# EAGLE design Charger Control Board rev6 (EAGLE 9.6.2)

## Sheet 1 of 2: Main
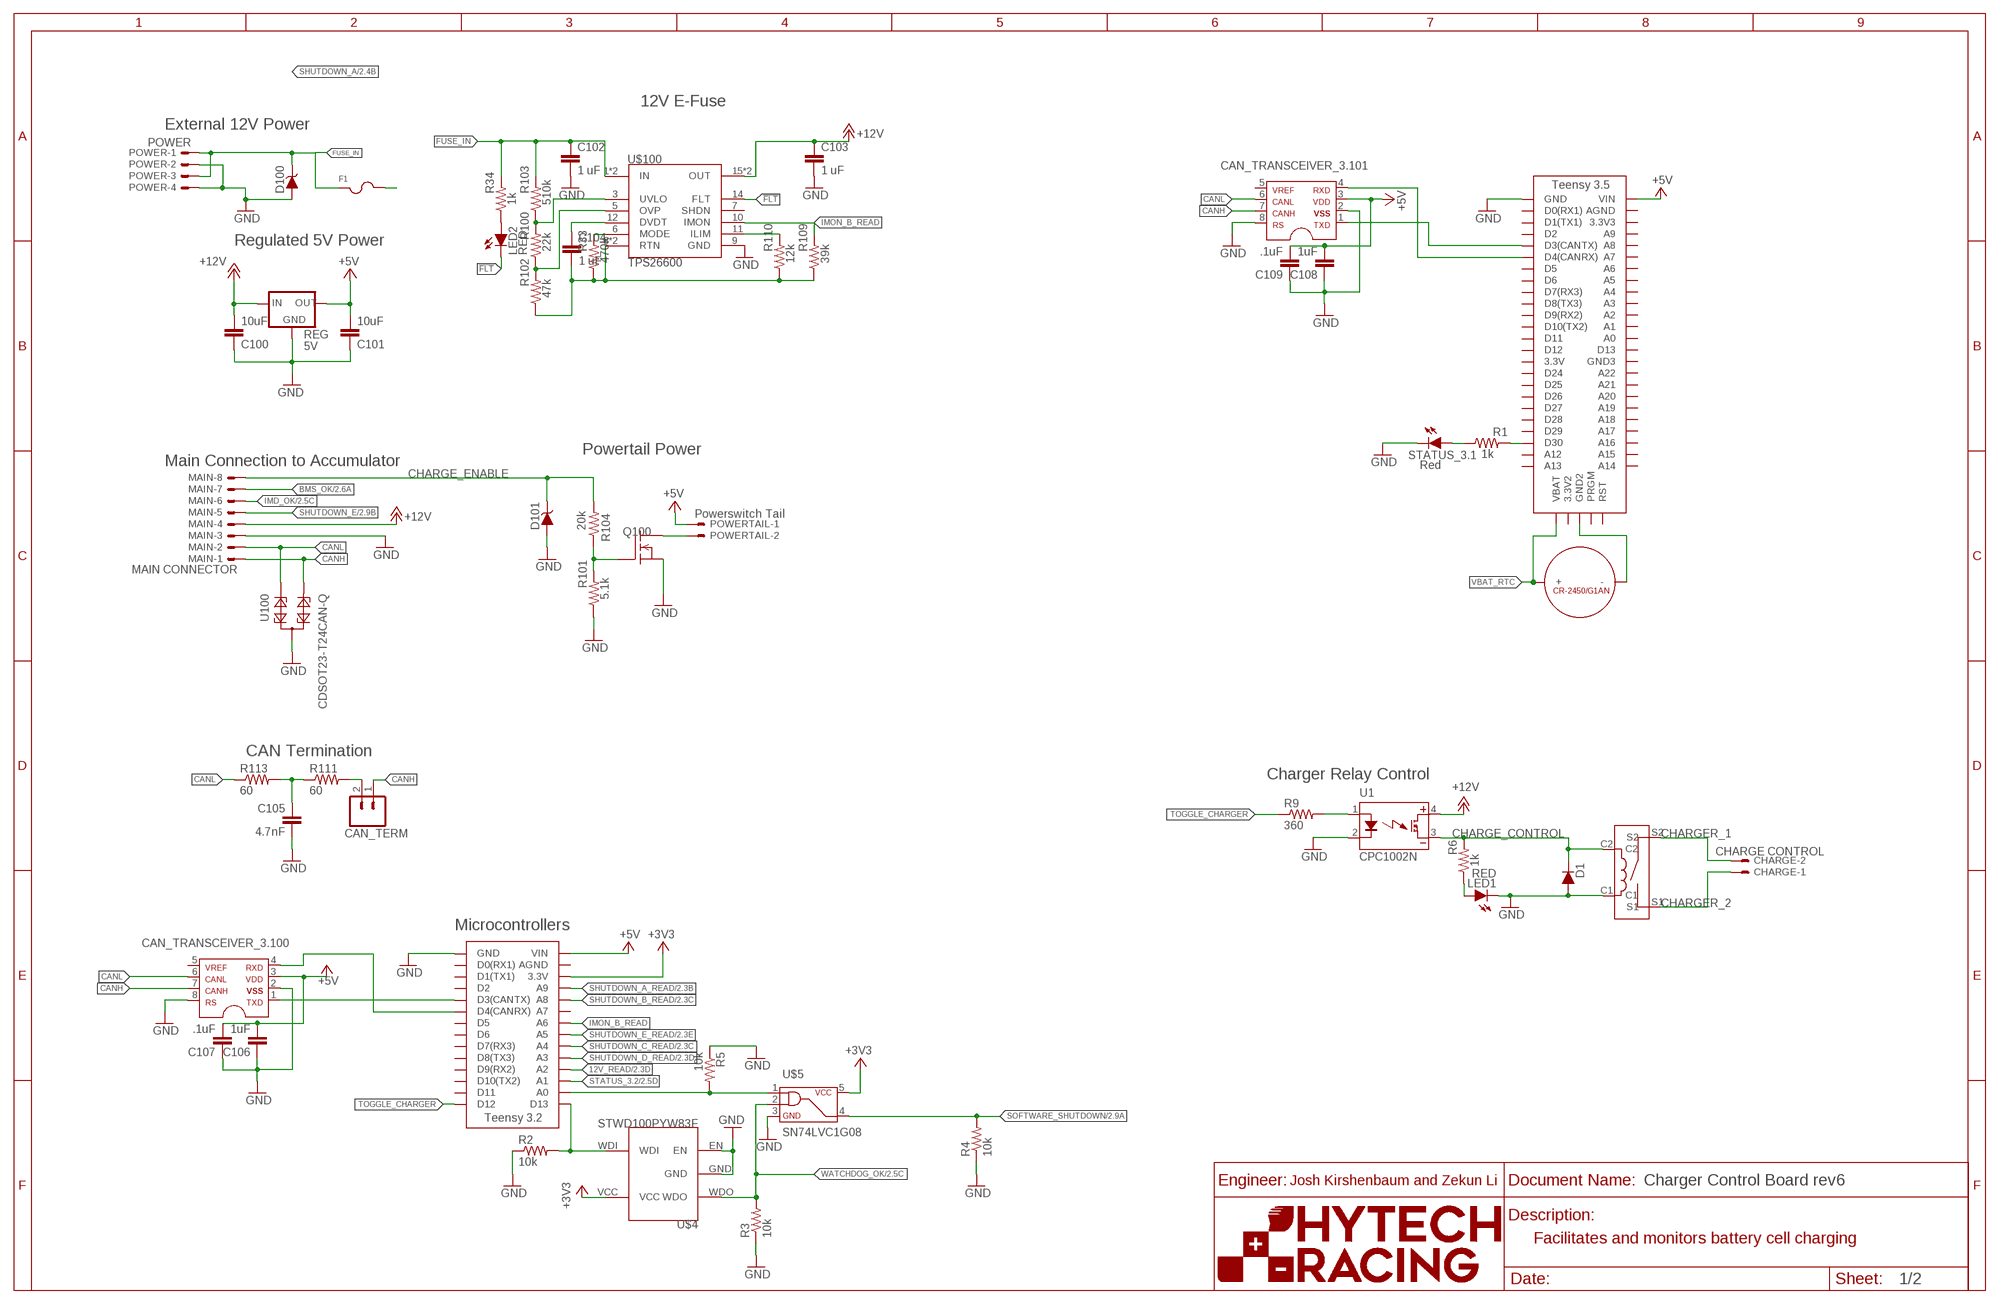
[diagram p0: schematic, sheet 1]
U$6 (FRAME_B_L): ORIENTATION: LANDSCAPE; SIZE: B

### Parts
$$$$U$100  CR-2450/G1AN  [CR-2450/G1AN]
$$U$6  TEENSY_3.2_SIMPLE  [TEENSY_3.2_SIMPLE]
$$U$7  KT12-1A-40L-THT  [KT12-1A-40L-THT]
C100  10uF  CAP0603-CAP  [0603-CAP]
C101  10uF  CAP0603-CAP  [0603-CAP]
C102  1 uF  CAP0603-CAP  [0603-CAP]
C103  1 uF  CAP0603-CAP  [0603-CAP]
C104  1 uF  CAP0603-CAP  [0603-CAP]
C105  4.7nF  CAP0603-CAP  [0603-CAP]
C106  1uF  CAP0603-CAP  [0603-CAP]
C107  .1uF  CAP0603-CAP  [0603-CAP]
C108  1uF  CAP0603-CAP  [0603-CAP]
C109  .1uF  CAP0603-CAP  [0603-CAP]
CAN_TERM  M02_SLIM  [1X02_SLIM]
CAN_TRANSCEIVER_3.100  MCP2551  [SOIC-08]
CAN_TRANSCEIVER_3.101  MCP2551  [SOIC-08]
CHARGE  CHARGE CONTROL  CONNECTOR-2NANO-FIT_VERTICAL-2  [NANO-FIT_VERTICAL-2]
D1  DIODE  DIODE0805  [0805_D]
D100  DIODE_ZENER0603  [0603_D]
D101  DIODE_ZENER  [SOT23]
F1  FUSE_MINIBLADE  [MINI-BLADE_FUSE_HOLDER]
LED1  RED  LED-0603  [LED-603]
LED2  RED  LED-0603  [LED-603]
MAIN  MAIN CONNECTOR  CONNECTOR-8NANO-FIT_VERTICAL-8  [NANO-FIT_VERTICAL-8]
POWER  POWER  CONNECTOR-4NANO-FIT-VERTICAL-4  [NANO-FIT_VERTICAL-4]
POWERTAIL  Powerswitch Tail  CONNECTOR-2NANO-FIT_VERTICAL-2  [NANO-FIT_VERTICAL-2]
Q100  DMG3406LSOT  [SOT23]
R1  1k  RESISTOR0603-RES  [0603-RES]
R2  10k  RESISTOR0603  [0603-RES]
R3  10k  RESISTOR0603  [0603-RES]
R4  10k  RESISTOR0603  [0603-RES]
R5  10k  RESISTOR0603  [0603-RES]
R6  1k  RESISTOR0603-RES  [0603-RES]
R9  360  RESISTOR0603-RES  [0603-RES]
R33  470k  RESISTOR0603-RES  [0603-RES]
R34  1k  RESISTOR0603-RES  [0603-RES]
R100  22k  RESISTOR0603-RES  [0603-RES]
R101  5.1k  RESISTOR0603-RES  [0603-RES]
R102  47k  RESISTOR0603-RES  [0603-RES]
R103  510k  RESISTOR0603-RES  [0603-RES]
R104  20k  RESISTOR0603-RES  [0603-RES]
R109  39k  RESISTOR0603-RES  [0603-RES]
R110  12k  RESISTOR0603-RES  [0603-RES]
R111  60  RESISTOR0603-RES  [0603-RES]
R113  60  RESISTOR0603-RES  [0603-RES]
REG  5V  OKI-78SR-5  [OKI-78SR]
STATUS_3.1  Red  LED-0603  [LED-603]
U1  CPC1002N  [SOP04]
U100  CDSOT23-T24CAN-Q  [SOT23]
U$3  TEENSY_3.5_EXT_RTC  [TEENSY_3.5_EXT_RTC]
U$4  STWD100PYW83F  [SOT323-5]
U$5  SN74LVC1G08  [SOT-23-5]
U$100  TPS26600  [HTSSOP-16]

### Nets
12V_READ: $$U$6.A2 ; also sheet 2
!FLT!: LED2.C U$100.14(FLT)
+3V3: $$U$6.3.3V U$4.VCC U$5.5
+5V: $$U$6.VIN C101.2 C106.2 C107.2 C108.2 C109.2 CAN_TRANSCEIVER_3.100.3 CAN_TRANSCEIVER_3.101.3 POWERTAIL.P$1 REG.3(OUT) U$3.VIN ; also sheet 2
+12V: C100.2 C103.1 MAIN.P$4 REG.1(IN) U1.4(DC+) U$100.15(OUT) U$100.16(OUT) ; also sheet 2
BMS_OK: MAIN.P$7 ; also sheet 2
CANH: CAN_TERM.1 CAN_TRANSCEIVER_3.100.7 CAN_TRANSCEIVER_3.101.7 MAIN.P$1 U100.2
CANL: CAN_TRANSCEIVER_3.100.6 CAN_TRANSCEIVER_3.101.6 MAIN.P$2 R113.1 U100.1
CHARGE_CONTROL: $$U$7.C2 D1.C R6.2 U1.3(DC-)
CHARGE_ENABLE: D101.3(C) MAIN.P$8 R104.2
CHARGER_1: $$U$7.S1 CHARGE.P$1
CHARGER_2: $$U$7.S2 CHARGE.P$2
DVDT_A: C104.1 U$100.12(DVDT)
FUSE_IN: C102.1 D100.C F1.L1 F1.L2 POWER.P$1 POWER.P$3 R34.2 R103.2 U$100.1(IN) U$100.2(IN)
GND: $$U$6.GND $$U$7.C1 C100.1 C101.1 C102.2 C103.2 C105.2 C106.1 C107.1 C108.1 C109.1 CAN_TRANSCEIVER_3.100.2 CAN_TRANSCEIVER_3.100.8 CAN_TRANSCEIVER_3.101.2 CAN_TRANSCEIVER_3.101.8 D1.A D100.A D101.1(A) LED1.C MAIN.P$3 POWER.P$2 POWER.P$4 Q100.2(S) R2.1 R3.1 R4.1 R5.1 R101.1 REG.2(GND) STATUS_3.1.C U1.2(CONTROL-) U100.3 U$3.GND U$4.EN U$4.GND U$5.3 U$100.9(GND) ; also sheet 2
ILIM_A: R110.2 U$100.11(ILIM)
IMD_OK: MAIN.P$6 ; also sheet 2
IMON_B_READ: $$U$6.A6 R109.2 U$100.10(IMON)
N$1: POWERTAIL.P$2 Q100.3(D)
N$4: CAN_TRANSCEIVER_3.101.4 U$3.D4(CANRX)
N$5: Q100.1(G) R101.2 R104.1
N$6: CAN_TRANSCEIVER_3.101.1 U$3.D3(CANTX)
N$7: R1.1 STATUS_3.1.A
N$9: R1.2 U$3.D30
N$10: R9.2 U1.1(CONTROL+)
N$11: $$U$6.A0 R5.2 U$5.1
N$15: $$U$6.D4(CANRX) CAN_TRANSCEIVER_3.100.4
N$16: $$U$6.D13 R2.2 U$4.WDI
N$17: CAN_TERM.2 R111.2
N$22: $$U$6.D3(CANTX) CAN_TRANSCEIVER_3.100.1
N$35: R33.2 U$100.6(MODE)
N$36: LED2.A R34.1
N$40: LED1.A R6.1
N$61: $$$$U$100.- U$3.GND2
N$62: C105.1 R111.1 R113.2
OVP_A: R100.1 R102.2 U$100.5(OVP)
RTN_A: C104.2 R33.1 R102.1 R109.1 R110.1 U$100.8(RTN) U$100.PAD(RTN)
SHUTDOWN_A: F1.R1 F1.R2 ; also sheet 2
SHUTDOWN_A_READ: $$U$6.A9 ; also sheet 2
SHUTDOWN_B_READ: $$U$6.A8 ; also sheet 2
SHUTDOWN_C_READ: $$U$6.A4 ; also sheet 2
SHUTDOWN_D_READ: $$U$6.A3 ; also sheet 2
SHUTDOWN_E: MAIN.P$5 ; also sheet 2
SHUTDOWN_E_READ: $$U$6.A5 ; also sheet 2
SOFTWARE_SHUTDOWN: R4.2 U$5.4 ; also sheet 2
STATUS_3.2: $$U$6.A1 ; also sheet 2
TOGGLE_CHARGER: $$U$6.D12 R9.1
UVLO_A: R100.2 R103.1 U$100.3(UVLO)
VBAT_RTC: $$$$U$100.+_0(+) $$$$U$100.+_1(+) U$3.VBAT
WATCHDOG_OK: R3.2 U$4.WDO U$5.2 ; also sheet 2
Unconnected: $$U$6.A7 $$U$6.AGND $$U$6.D0(RX1) $$U$6.D1(TX1) $$U$6.D2 $$U$6.D5 $$U$6.D6 $$U$6.D7(RX3) $$U$6.D8(TX3) $$U$6.D9(RX2) $$U$6.D10(TX2) $$U$6.D11 CAN_TRANSCEIVER_3.100.5 CAN_TRANSCEIVER_3.101.5 U$3.3.3V U$3.3.3V2 U$3.3.3V3 U$3.A0 U$3.A1 U$3.A2 U$3.A3 U$3.A4 U$3.A5 U$3.A6 U$3.A7 U$3.A8 U$3.A9 U$3.A12 U$3.A13 U$3.A14 U$3.A15 U$3.A16 U$3.A17 U$3.A18 U$3.A19 U$3.A20 U$3.A21 U$3.A22 U$3.AGND U$3.D0(RX1) U$3.D1(TX1) U$3.D2 U$3.D5 U$3.D6 U$3.D7(RX3) U$3.D8(TX3) U$3.D9(RX2) U$3.D10(TX2) U$3.D11 U$3.D12 U$3.D13 U$3.D24 U$3.D25 U$3.D26 U$3.D27 U$3.D28 U$3.D29 U$3.GND3 U$3.PRGM U$3.RST U$100.7(SHDN)

### Notes on the sheet
- 12V E-Fuse
- External 12V Power
- Regulated 5V Power
- Powertail Power
- Main Connection to Accumulator
- CAN Termination
- Charger Relay Control
- Microcontrollers
- Josh Kirshenbaum and Zekun Li
- Facilitates and monitors battery cell charging

## Sheet 2 of 2: Shutdown Circuit
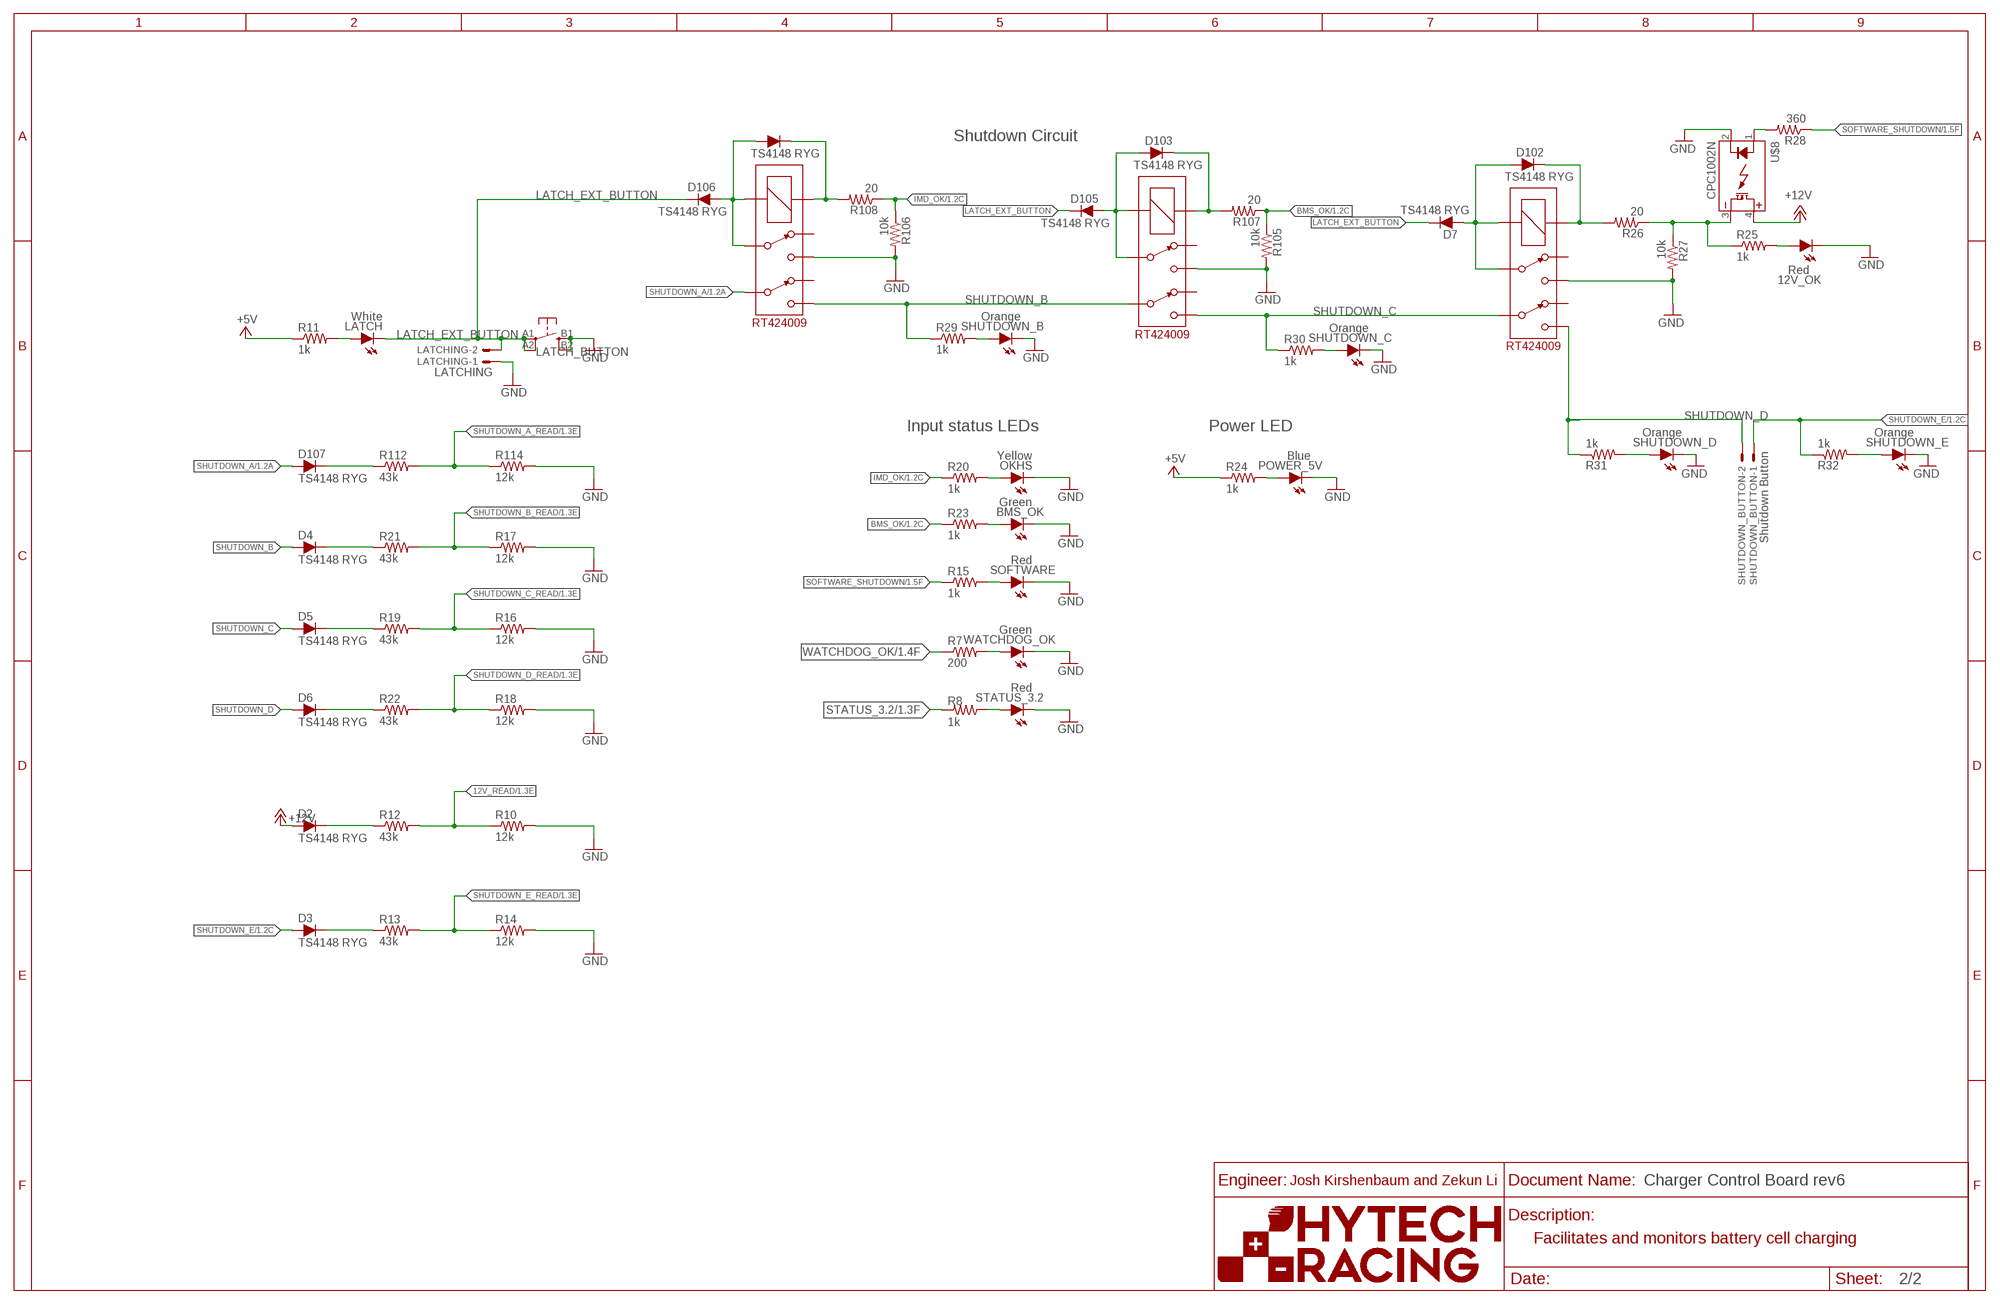
[diagram p1: schematic, sheet 2]
U$7 (FRAME_B_L): ORIENTATION: LANDSCAPE; SIZE: B

### Parts
12V_OK  Red  LED-0603  [LED-603]
BMS_OK  Green  LED-0603  [LED-603]
BMS_SHUTDOWN_RLY  RT424009  [RELAY_DPDT]
BMS_SHUTDOWN_RLY1  RT424009  [RELAY_DPDT]
D2  TS4148 RYG  DIODE0805  [0805_D]
D3  TS4148 RYG  DIODE0805  [0805_D]
D4  TS4148 RYG  DIODE0805  [0805_D]
D5  TS4148 RYG  DIODE0805  [0805_D]
D6  TS4148 RYG  DIODE0805  [0805_D]
D7  TS4148 RYG  DIODE0805  [0805_D]
D102  TS4148 RYG  DIODE0805  [0805_D]
D103  TS4148 RYG  DIODE0805  [0805_D]
D104  TS4148 RYG  DIODE0805  [0805_D]
D105  TS4148 RYG  DIODE0805  [0805_D]
D106  TS4148 RYG  DIODE0805  [0805_D]
D107  TS4148 RYG  DIODE0805  [0805_D]
IMD_SHUTDOWN_RLY  RT424009  [RELAY_DPDT]
LATCH  White  LED-0603  [LED-603]
LATCH_BUTTON  BTN_10-XXSMD  [TACTILE_SWITCH_SMD_6.2MM_TALL]
LATCHING  LATCHING  CONNECTOR-2NANO-FIT_VERTICAL-2  [NANO-FIT_VERTICAL-2]
OKHS  Yellow  LED-0603  [LED-603]
POWER_5V  Blue  LED-0603  [LED-603]
R7  200  RESISTOR0603-RES  [0603-RES]
R8  1k  RESISTOR0603-RES  [0603-RES]
R10  12k  RESISTOR0603-RES  [0603-RES]
R11  1k  RESISTOR0603-RES  [0603-RES]
R12  43k  RESISTOR0603-RES  [0603-RES]
R13  43k  RESISTOR0603-RES  [0603-RES]
R14  12k  RESISTOR0603-RES  [0603-RES]
R15  1k  RESISTOR0603-RES  [0603-RES]
R16  12k  RESISTOR0603-RES  [0603-RES]
R17  12k  RESISTOR0603-RES  [0603-RES]
R18  12k  RESISTOR0603-RES  [0603-RES]
R19  43k  RESISTOR0603-RES  [0603-RES]
R20  1k  RESISTOR0603-RES  [0603-RES]
R21  43k  RESISTOR0603-RES  [0603-RES]
R22  43k  RESISTOR0603-RES  [0603-RES]
R23  1k  RESISTOR0603-RES  [0603-RES]
R24  1k  RESISTOR0603-RES  [0603-RES]
R25  1k  RESISTOR0603-RES  [0603-RES]
R26  20  RESISTOR0603-RES  [0603-RES]
R27  10k  RESISTOR0603-RES  [0603-RES]
R28  360  RESISTOR0603-RES  [0603-RES]
R29  1k  RESISTOR0603-RES  [0603-RES]
R30  1k  RESISTOR0603-RES  [0603-RES]
R31  1k  RESISTOR0603-RES  [0603-RES]
R32  1k  RESISTOR0603-RES  [0603-RES]
R105  10k  RESISTOR0603-RES  [0603-RES]
R106  10k  RESISTOR0603-RES  [0603-RES]
R107  20  RESISTOR0603-RES  [0603-RES]
R108  20  RESISTOR0603-RES  [0603-RES]
R112  43k  RESISTOR0603-RES  [0603-RES]
R114  12k  RESISTOR0603-RES  [0603-RES]
SHUTDOWN_B  Orange  LED-0603  [LED-603]
SHUTDOWN_BUTTON  Shutdown Button  CONNECTOR-2NANO-FIT_VERTICAL-2  [NANO-FIT_VERTICAL-2]
SHUTDOWN_C  Orange  LED-0603  [LED-603]
SHUTDOWN_D  Orange  LED-0603  [LED-603]
SHUTDOWN_E  Orange  LED-0603  [LED-603]
SOFTWARE  Red  LED-0603  [LED-603]
STATUS_3.2  Red  LED-0603  [LED-603]
U$8  CPC1002N  [SOP04]
WATCHDOG_OK  Green  LED-0603  [LED-603]

### Nets
12V_READ: R10.1 R12.2 ; also sheet 1
+5V: R11.1 R24.1 ; also sheet 1
+12V: D2.A U$8.4(DC+) ; also sheet 1
BMS_OK: R23.1 R105.1 R107.1 ; also sheet 1
BMS_OK_RELAY: BMS_SHUTDOWN_RLY.COIL+ D103.C R107.2
BMS_PWR_STEP: BMS_SHUTDOWN_RLY.3 BMS_SHUTDOWN_RLY.COIL- D103.A D105.A
GND: 12V_OK.C BMS_OK.C BMS_SHUTDOWN_RLY1.4 BMS_SHUTDOWN_RLY.4 IMD_SHUTDOWN_RLY.4 LATCH_BUTTON.B1(S) LATCH_BUTTON.B2(S1) LATCHING.P$1 OKHS.C POWER_5V.C R10.2 R14.2 R16.2 R17.2 R18.2 R27.2 R105.2 R106.2 R114.2 SHUTDOWN_B.C SHUTDOWN_C.C SHUTDOWN_D.C SHUTDOWN_E.C SOFTWARE.C STATUS_3.2.C U$8.2(CONTROL-) WATCHDOG_OK.C ; also sheet 1
IMD_OK: R20.1 R106.1 R108.1 ; also sheet 1
IMD_PWR_STEP: D104.A D106.A IMD_SHUTDOWN_RLY.3 IMD_SHUTDOWN_RLY.COIL-
LATCH_EXT_BUTTON: D7.C D105.C D106.C LATCH.C LATCH_BUTTON.A1(P) LATCH_BUTTON.A2(P1) LATCHING.P$2
N$2: LATCH.A R11.2
N$3: BMS_OK.A R23.2
N$8: R8.1 STATUS_3.2.A
N$12: D104.C IMD_SHUTDOWN_RLY.COIL+ R108.2
N$13: R25.1 R26.1 R27.1 U$8.3(DC-)
N$14: D107.C R112.1
N$18: D4.C R21.1
N$19: R29.2 SHUTDOWN_B.A
N$20: D5.C R19.1
N$21: D6.C R22.1
N$23: BMS_SHUTDOWN_RLY1.3 BMS_SHUTDOWN_RLY1.COIL- D7.A D102.A
N$24: R7.2 WATCHDOG_OK.A
N$25: POWER_5V.A R24.2
N$26: OKHS.A R20.2
N$27: R28.2 U$8.1(CONTROL+)
N$28: D3.C R13.1
N$29: R32.2 SHUTDOWN_E.A
N$30: R31.2 SHUTDOWN_D.A
N$31: R15.2 SOFTWARE.A
N$32: R30.2 SHUTDOWN_C.A
N$33: BMS_SHUTDOWN_RLY1.COIL+ D102.C R26.2
N$34: 12V_OK.A R25.2
N$42: D2.C R12.1
SHUTDOWN_A: D107.A IMD_SHUTDOWN_RLY.6 ; also sheet 1
SHUTDOWN_A_READ: R112.2 R114.1 ; also sheet 1
SHUTDOWN_B: BMS_SHUTDOWN_RLY.6 D4.A IMD_SHUTDOWN_RLY.5 R29.1
SHUTDOWN_B_READ: R17.1 R21.2 ; also sheet 1
SHUTDOWN_C: BMS_SHUTDOWN_RLY1.6 BMS_SHUTDOWN_RLY.5 D5.A R30.1
SHUTDOWN_C_READ: R16.1 R19.2 ; also sheet 1
SHUTDOWN_D: BMS_SHUTDOWN_RLY1.5 D6.A R31.1 SHUTDOWN_BUTTON.P$2
SHUTDOWN_D_READ: R18.1 R22.2 ; also sheet 1
SHUTDOWN_E: D3.A R32.1 SHUTDOWN_BUTTON.P$1 ; also sheet 1
SHUTDOWN_E_READ: R13.2 R14.1 ; also sheet 1
SOFTWARE_SHUTDOWN: R15.1 R28.1 ; also sheet 1
STATUS_3.2: R8.2 ; also sheet 1
WATCHDOG_OK: R7.1 ; also sheet 1
Unconnected: BMS_SHUTDOWN_RLY1.2 BMS_SHUTDOWN_RLY1.7 BMS_SHUTDOWN_RLY.2 BMS_SHUTDOWN_RLY.7 IMD_SHUTDOWN_RLY.2 IMD_SHUTDOWN_RLY.7

### Notes on the sheet
- Shutdown Circuit
- Input status LEDs | Power LED
- Josh Kirshenbaum and Zekun Li
- Facilitates and monitors battery cell charging

## Library data of the parts
12V_OK BMS_OK LATCH LED1 LED2 OKHS POWER_5V SHUTDOWN_B SHUTDOWN_C SHUTDOWN_D SHUTDOWN_E SOFTWARE STATUS_3.1 STATUS_3.2 WATCHDOG_OK = HyTechDevices:LED: Light Emitting Diode (LED) Source: Dangerous Prototypes Eagle Library <https://github.com/DangerousPrototypes/Eagle_Part_Library>
$$$$U$100 = HyTechDevices:CR-2450/G1AN: Panasonic CR2450 Battery through hole.
$$U$6 = HyTechDevices:TEENSY_3.2_SIMPLE: Simple version of the Teensy 3.2 board that only uses the 2 main rows of pins, with no perpendicular row with VBat or inner pins.
$$U$7 = HyTechDevices:KT12-1A-40L-THT
BMS_SHUTDOWN_RLY BMS_SHUTDOWN_RLY1 IMD_SHUTDOWN_RLY = HyTechDevices:RT424009: TE/Schrack Double Pull Double Throw Relay 9VDC Datasheet <https://www.mouser.com/datasheet/2/418/NG_DS_RT2_1014-736201.pdf> Product Page <https://www.te.com/usa-en/product-6-1393243-2.html>
C100 = HyTechDevices:CAP: Capacitor Standard 0603 ceramic capacitor, and 0.1" leaded capacitor.; TOLERANCE: 1%; VOLTAGE: 25V
C101 = HyTechDevices:CAP: Capacitor Standard 0603 ceramic capacitor, and 0.1" leaded capacitor.; TOLERANCE: 5%; VOLTAGE: 25V
C102-C104 = HyTechDevices:CAP: Capacitor Standard 0603 ceramic capacitor, and 0.1" leaded capacitor.
C105 = HyTechDevices:CAP: Capacitor Standard 0603 ceramic capacitor, and 0.1" leaded capacitor.; TOLERANCE: 5%; VOLTAGE: 50V
C106-C109 = HyTechDevices:CAP: Capacitor Standard 0603 ceramic capacitor, and 0.1" leaded capacitor.; TOLERANCE: 5%; VOLTAGE: 10V
CAN_TERM = HyTechDevices:M02: Standard 2-pin 0.1" header. NOTES ON THE VARIANTS LOCK and LOCK_LONGPADS... This footprint was designed to help hold the alignment of a through-hole component (i.e. 6-pin header) while soldering it into place. You may notice that each hole has been shifted either up or down by 0.005 of an inch from it's more standard position (which is a perfectly straight line). This slight alteration caused the pins (the squares in the middle) to touch the edges of the holes. Because they are alternating, it causes a "brace" to hold the component in place. 0.005 has proven to be the perfect amount of "off-center" position when using our standard breakaway headers. Although looks a little odd when you look at the bare footprint, once you have a header in there, the alteration is very hard to notice. Also,if you push a header all the way into place, it is covered up entirely on the bottom side. This idea of altering the position of holes to aid alignment will be further integrated into the Sparkfun Library for other footprints. It can help hold any component with 3 or more connection pins. Note: The Sparkfun version includes many other packages including surface mount that may be of future interest. Source: Sparkfun <https://github.com/sparkfun/SparkFun-Eagle-Libraries>
CAN_TRANSCEIVER_3.100 CAN_TRANSCEIVER_3.101 = HyTechDevices:MCP2551: MCP2551 High-Speed CAN Transceiver Product Webpage <https://www.microchip.com/wwwproducts/en/MCP2551> Datasheet <http://ww1.microchip.com/downloads/en/DeviceDoc/21667f.pdf> This device is outdated It is replaced by MCP2561. Comparison Page <https://www.microchip.com/wwwproducts/ProductCompare/MCP2551/MCP2561> Product Webpage <https://www.microchip.com/wwwproducts/en/MCP2561> Datasheet <http://ww1.microchip.com/downloads/en/DeviceDoc/20005167C.pdf>
CHARGE LATCHING POWERTAIL SHUTDOWN_BUTTON = HyTechDevices:CONNECTOR-2: Mini-Fit Junior connector 2 pole Source: http://www.molex.com
D1-D7 D102-D107 = HyTechDevices:DIODE: DIODE general purpose rectifier
D100 D101 = HyTechDevices:DIODE_ZENER: ZENER DIODE
F1 = HyTechDevices:FUSE: Fuse/Fuseclips Keystone Electronics 3568 Fuse Mouser Part <http://www.mouser.com/ProductDetail/Keystone-Electronics/3568> Datasheet <http://www.mouser.com/ds/2/215/568-742601.pdf> Bussman/Eaton Midget Fuse Clip 1A3400 <http://www.mouser.com/ProductDetail/Bussmann-Eaton/BK-1A3400-09-R/?qs=sGAEpiMZZMuG%252bgnN5hGYGzzlAelq2OxnKqVSMVjq8I4%3d> Schurter 0751.0110 Brass Fuse Clip Datasheet <http://www.mouser.com/ds/2/358/typ_OG__Clip__5x20-2553.pdf> Bel Fuse 0ZCF Series Surface Mount PTC (resettable) Fuse Datasheet <https://belfuse.com/resources/CircuitProtection/datasheets/0ZCF%20Nov2016.pdf> Littelfuse 1812L Series Surface Mount PTC (resettable) Fuse Datasheet <https://m.littelfuse.com/~/media/electronics/datasheets/resettable_ptcs/littelfuse_ptc_1812l_datasheet.pdf.pdf>
LATCH_BUTTON = HyTechDevices:BTN_10-XX: Small momentary tactile push button
MAIN = HyTechDevices:CONNECTOR-8: Mini-Fit Junior connector 8 pole Source: http://www.molex.com
POWER = HyTechDevices:CONNECTOR-4: Mini-Fit Junior connector 4 pole Source: http://www.molex.com
Q100 = HyTechDevices:DMG3406L: Generic NPN MOSFET DMG3406L (SOT-23, 2.8 A 30V)
R1 R6 R8 R9 R11 R20 R23-R26 R28-R30 R33 R34 R100-R111 R113 = HyTechDevices:RESISTOR: Resistor Basic schematic elements and footprints for 0603, 1206, and PTH resistors.; TOLERANCE: 1%
R2-R5 R7 R10 R12-R19 R21 R22 R27 R31 R32 R112 R114 = HyTechDevices:RESISTOR: Resistor Basic schematic elements and footprints for 0603, 1206, and PTH resistors.
REG = HyTechDevices:OKI-78SR-5: Murata OKI-78SR 5V 1.5A Non-Isolated Switching Regulator DC/DC - Datasheet <https://power.murata.com/data/power/oki-78sr.pdf>
U1 U$8 = HyTechDevices:CPC1002N: IXYS Solid State Relay .7A
U100 = HyTechDevices:CDSOT23-T24CAN-Q: CAN Bus dual TVS array for transceiver ESD and surge protection
U$3 = HyTechDevices:TEENSY_3.5_EXT_RTC: Extended version of the Teensy 3.5 board that only uses the 2 main rows of pins, plus the perpendicular row with VBat.
U$4 = HyTechDevices:STWD100PYW83F: STWD100 Watchdog Timer (push-pull configuration) Datasheet <https://www.st.com/resource/en/datasheet/stwd100.pdf>
U$5 = HyTechDevices:SN74LVC1G08: TI SN74LVC1G08 SINGLE 2-INPUT POSITIVE-AND GATE Datasheet <http://www.ti.com/lit/ds/sces556f/sces556f.pdf>
U$100 = HyTechDevices:TPS26600

## Board
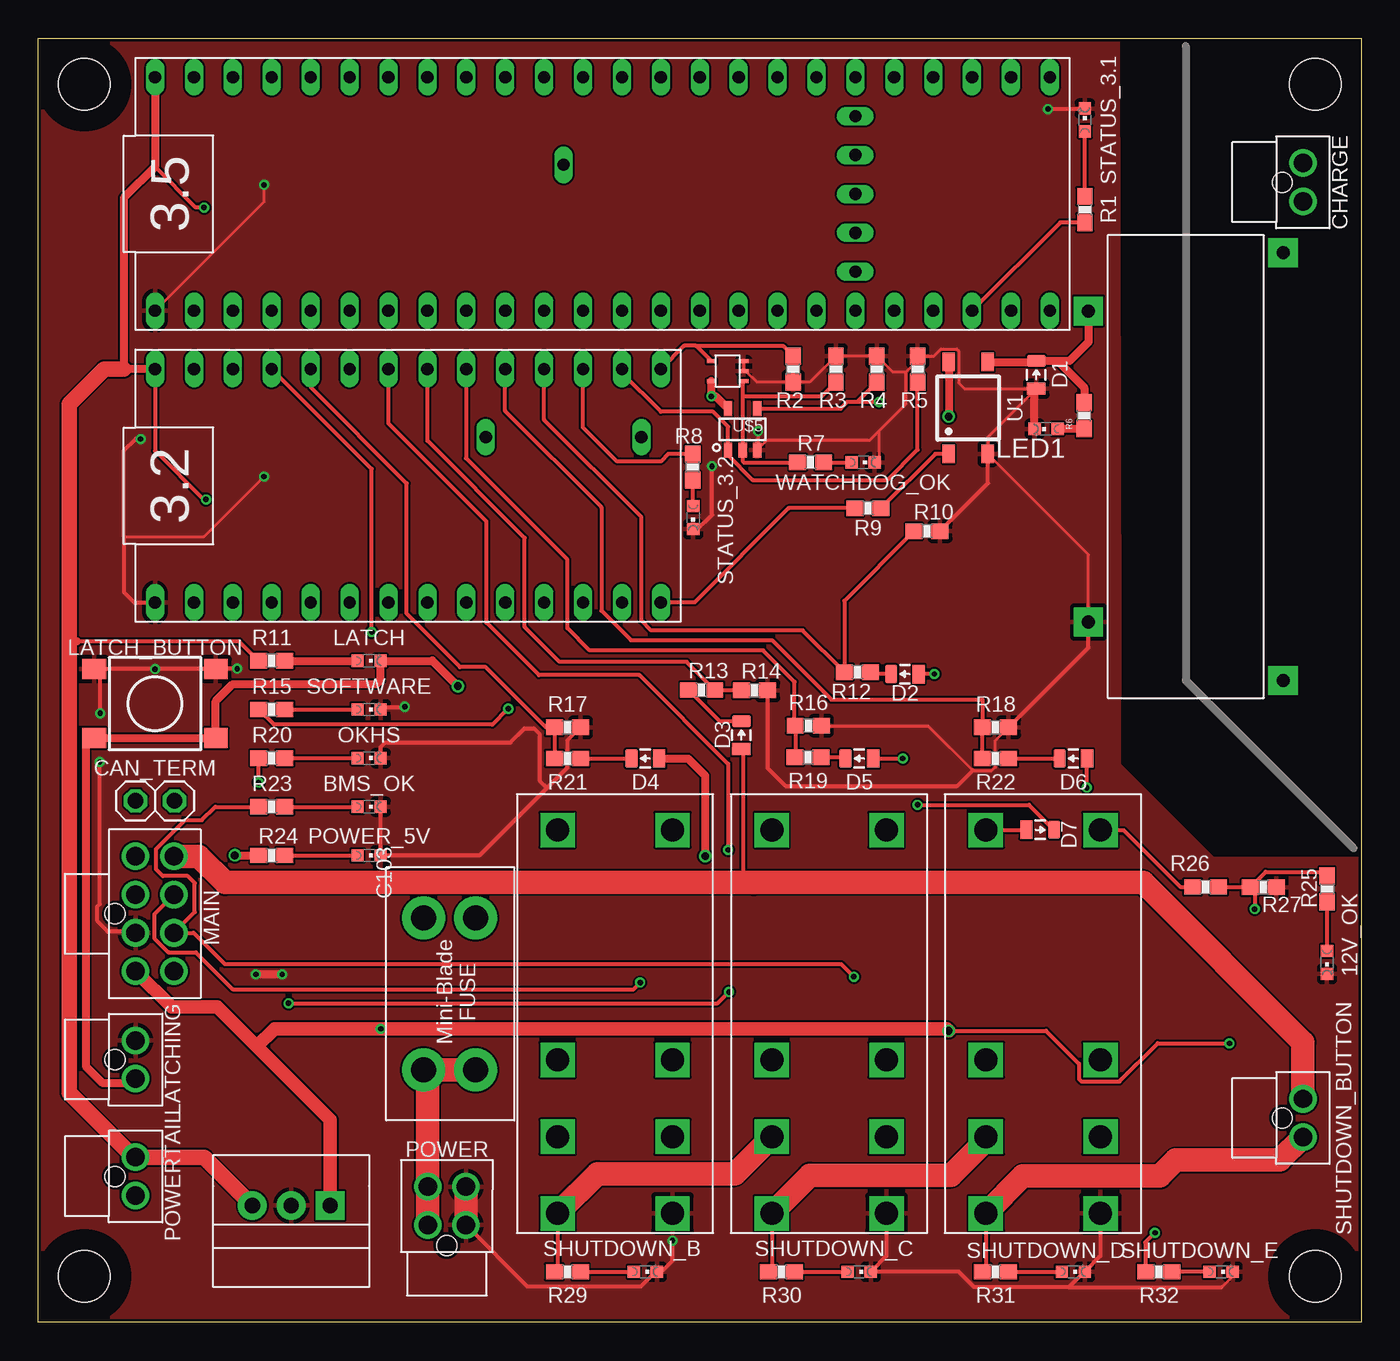
[diagram p2: board, top side]
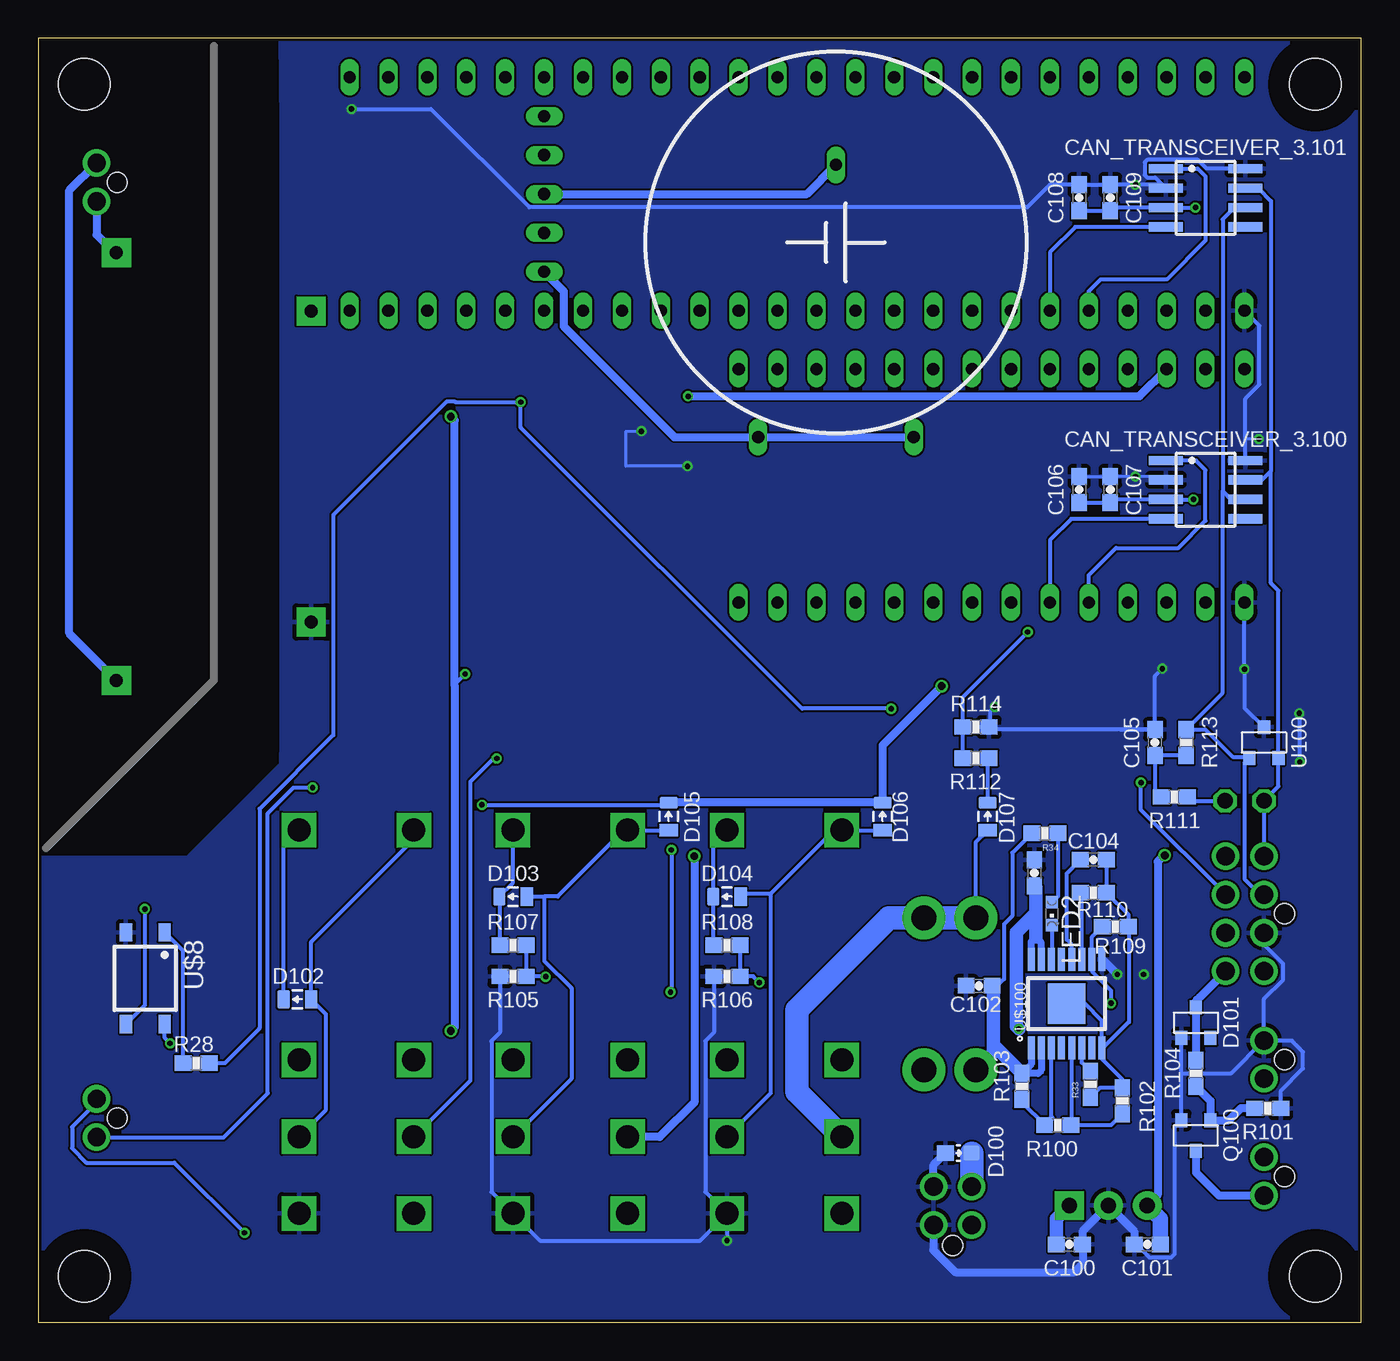
[diagram p3: board, bottom side, seen from below]

Size 86.36 x 83.82 mm. Coordinates in mm from the lower left corner, seen from the top.
Outline: 0,83.82 86.36,83.82 86.36,0 0,0 0,83.82
Copper layers (1*16): Top 0.035mm / dielectric 1.53mm / Bottom 0.035mm
Design rules "JLCPCB (2 Layer)": minimum track width 5mil, minimum drill 0.3mm, track to track 5mil, track to pad 5mil, pad to pad 5mil, via to via 20mil, smd to smd 5mil, copper to edge 0.2mm, drill to drill 21mil, minimum pad ring 6mil, minimum via ring 6mil, stop-mask expansion 2mil, vias tented up to drill 30mil, thermal gap 10mil

### Footprints (pad centres in the part's own frame; a part is rotated, then mirrored left to right if it is on the bottom)
LED-603 = smd 0.8 x 0.8: A 0,-0.75; C 0,0.75
CR-2450/G1AN = drill 0.8 long: +_0 -5.08,12.7; +_1 5.08,12.7; - 0,-5.08
M3_MOUNTING = hole 3.353: 0,0
TEENSY_3.2_SIMPLE = drill 0.8 long: 3.3V 16.51,29.21; A0 16.51,3.81; A1 16.51,6.35; A2 16.51,8.89; A3 16.51,11.43; A4 16.51,13.97; A5 16.51,16.51; A6 16.51,19.05; A7 16.51,21.59; A8 16.51,24.13; A9 16.51,26.67; AGND 16.51,31.75; D0(RX1) 1.27,31.75; D1(TX1) 1.27,29.21; D2 1.27,26.67; D3(CANTX) 1.27,24.13; D4(CANRX) 1.27,21.59; D5 1.27,19.05; D6 1.27,16.51; D7(RX3) 1.27,13.97; D8(TX3) 1.27,11.43; D9(RX2) 1.27,8.89; D10(TX2) 1.27,6.35; D11 1.27,3.81; D12 1.27,1.27; D13 16.51,1.27; GND 1.27,34.29; VIN 16.51,34.29
KT12-1A-40L-THT = drill 0.85 pad 1.9 square: C1 4.95,11.45; C2 25.25,11.45; S1 1.13,-1.25; S2 29.07,-1.25
RELAY_DPDT = drill 1.5 square: 2 10.008,0; 3 5.004,0; 4 0,0; 5 0,7.493; 6 5.004,7.493; 7 10.008,7.493; COIL+ 25.019,0; COIL- 25.019,7.493
0603-CAP = smd 1.1 x 1: 1 -0.85,0; 2 0.85,0
1X02_SLIM = drill 1.016 octagon: 1 -1.27,0; 2 1.27,0
SOIC-08 = smd 0.6 x 2.2: 1 -1.905,-2.6; 2 -0.635,-2.6; 3 0.635,-2.6; 4 1.905,-2.6; 5 1.905,2.6; 6 0.635,2.6; 7 -0.635,2.6; 8 -1.905,2.6
NANO-FIT_VERTICAL-2 = drill 1.2: P$1 -1.25,0; P$2 1.25,0 | hole 1.3: 0,-1.34
0805_D = smd 0.8 x 1.2: A -0.9,0; C 0.9,0
0603_D = smd 1.1 x 1: A -0.85,0; C 0.85,0
SOT23 = smd 0.8 x 0.9: 1 -0.95,-1; 2 0.95,-1; 3 0,1
MINI-BLADE_FUSE_HOLDER = drill 1.613 pad 2.794: L1 0,3.404; L2 0,0; R1 9.906,3.404; R2 9.906,0
TACTILE_SWITCH_SMD_6.2MM_TALL = smd 1.55 x 1.3: A1 -3.975,-2.25; A2 3.975,-2.25; B1 -3.975,2.25; B2 3.975,2.25
NANO-FIT_VERTICAL-8 = drill 1.2: P$1 -3.75,0; P$2 -1.25,0; P$3 1.25,0; P$4 3.75,0; P$5 -3.75,2.5; P$6 -1.25,2.5; P$7 1.25,2.5; P$8 3.75,2.5 | hole 1.3: 0,-1.34
NANO-FIT_VERTICAL-4 = drill 1.2: P$1 -1.25,0; P$2 1.25,0; P$3 -1.25,2.5; P$4 1.25,2.5 | hole 1.3: 0,-1.34
0603-RES = smd 1.1 x 1: 1 -0.85,0; 2 0.85,0
OKI-78SR = drill 1 pad 1.88 square: 1 -2.54,0 | drill 1 pad 1.88: 2 0,0; 3 2.54,0
SOP04 = smd 0.8 x 1.2: 1 -1.27,-3; 2 1.27,-3; 3 1.27,3; 4 -1.27,3
TEENSY_3.5_EXT_RTC = drill 0.8 long: 3.3V 1.27,24.13; 3.3V2 6.35,13.97; 3.3V3 16.51,54.61; A0 16.51,29.21; A1 16.51,31.75; A2 16.51,34.29; A3 16.51,36.83; A4 16.51,39.37; A5 16.51,41.91; A6 16.51,44.45; A7 16.51,46.99; A8 16.51,49.53; A9 16.51,52.07; A12 1.27,3.81; A13 1.27,1.27; A14 16.51,1.27; A15 16.51,3.81; A16 16.51,6.35; A17 16.51,8.89; A18 16.51,11.43; A19 16.51,13.97; A20 16.51,16.51; A21 16.51,19.05; A22 16.51,21.59; AGND 16.51,57.15; D0(RX1) 1.27,57.15; D1(TX1) 1.27,54.61; D2 1.27,52.07; D3(CANTX) 1.27,49.53; D4(CANRX) 1.27,46.99; D5 1.27,44.45; D6 1.27,41.91; D7(RX3) 1.27,39.37; D8(TX3) 1.27,36.83; D9(RX2) 1.27,34.29; D10(TX2) 1.27,31.75; D11 1.27,29.21; D12 1.27,26.67; D13 16.51,26.67; D24 1.27,21.59; D25 1.27,19.05; D26 1.27,16.51; D27 1.27,13.97; D28 1.27,11.43; D29 1.27,8.89; D30 1.27,6.35; GND 1.27,59.69; GND2 8.89,13.97; GND3 16.51,24.13; PRGM 11.43,13.97; RST 13.97,13.97; VBAT 3.81,13.97; VIN 16.51,59.69
SOT323-5 = smd 0.61 x 0.254: EN -2.108,0; GND -2.108,0.635; VCC 0,1.295; WDI 0,0; WDO -2.108,1.295
SOT-23-5 = smd 1 x 0.55: 1 -1.35,0.95; 2 -1.35,0; 3 -1.35,-0.95; 4 1.35,-0.95; 5 1.35,0.95
HTSSOP-16 = smd 1.499 x 0.457: 1 -2.896,2.311; 2 -2.896,1.651; 3 -2.896,0.991; 4 -2.896,0.33; 5 -2.896,-0.33; 6 -2.896,-0.991; 7 -2.896,-1.651; 8 -2.896,-2.311; 9 2.896,-2.311; 10 2.896,-1.651; 11 2.896,-0.991; 12 2.896,-0.33; 13 2.896,0.33; 14 2.896,0.991; 15 2.896,1.651; 16 2.896,2.311 | smd 2.667 x 2.464: PAD 0,0

### Placement (x,y rotation side)
12V_OK  84.12,23.5 180 top
$$$$U$100  34.29,70.48 180 bottom
$$U$1  [M3_MOUNTING]  3,3 0 top
$$U$2  [M3_MOUNTING]  83.36,3 0 top
$$U$6  41.91,45.72 90 top
$$U$7  80.01,40.77 90 top
BMS_OK  21.59,33.66 270 top
BMS_SHUTDOWN_RLY  55.37,7.11 90 top
BMS_SHUTDOWN_RLY1  69.34,7.11 90 top
C100  19.05,5.08 180 bottom
C101  13.97,5.08 0 bottom
C102  24.94,21.97 180 bottom
C103  21.34,29.34 90 bottom
C104  17.48,30.2 0 bottom
C105  13.46,37.85 90 bottom
C106  18.41,54.36 270 bottom
C107  16.38,54.36 270 bottom
C108  18.41,73.41 270 bottom
C109  16.38,73.41 270 bottom
CAN_TERM  7.62,34.04 0 top
CAN_TRANSCEIVER_3.100  10.16,54.36 270 bottom
CAN_TRANSCEIVER_3.101  10.16,73.41 270 bottom
CHARGE  82.55,74.42 270 top
D1  65.15,61.85 90 top
D2  56.57,42.32 180 top
D3  45.9,38.33 90 top
D4  39.62,36.8 180 top
D5  53.59,36.8 180 top
D6  67.56,36.8 180 top
D7  65.41,32.16 0 top
D100  26.29,11.05 0 bottom
D101  10.79,19.56 0 bottom
D102  69.44,21.08 180 bottom
D103  55.37,27.79 180 bottom
D104  41.4,27.79 180 bottom
D105  45.21,33.02 90 bottom
D106  31.24,33.02 90 bottom
D107  24.38,33.02 90 bottom
F1  28.55,16.48 90 top
IMD_SHUTDOWN_RLY  41.4,7.11 90 top
LATCH  21.59,43.18 270 top
LATCH_BUTTON  7.62,40.39 0 top
LATCHING  6.35,17.14 270 top
LED1  65.79,58.32 90 top
LED2  20.19,26.67 180 bottom
MAIN  6.35,26.67 270 top
OKHS  21.59,36.83 270 top
POWER  26.67,6.35 0 top
POWER_5V  21.59,30.48 270 top
POWERTAIL  6.35,9.53 270 top
Q100  10.79,12.19 180 bottom
R1  68.33,72.64 270 top
R2  49.28,62.23 90 top
R3  52.07,62.23 270 top
R4  54.74,62.23 270 top
R5  57.4,62.23 270 top
R6  68.28,59.18 90 top
R7  50.42,56.13 0 top
R8  42.72,55.83 90 top
R9  54.15,53.14 0 top
R10  58.01,51.64 0 top
R11  15.24,43.18 0 top
R12  53.47,42.44 180 top
R13  43.31,41.27 0 top
R14  46.76,41.25 0 top
R15  15.24,40.01 0 top
R16  50.27,38.94 0 top
R17  34.54,38.84 0 top
R18  62.48,38.84 0 top
R19  50.24,36.88 180 top
R20  15.24,36.83 0 top
R21  34.54,36.8 180 top
R22  62.48,36.8 180 top
R23  15.24,33.66 0 top
R24  15.24,30.48 0 top
R25  84.12,28.3 270 top
R26  76.2,28.42 180 top
R27  79.96,28.4 0 top
R28  76.05,16.92 180 bottom
R29  34.54,3.3 0 top
R30  48.51,3.3 0 top
R31  62.48,3.3 0 top
R32  73.15,3.3 0 top
R33  17.68,15.54 90 bottom
R34  20.65,31.93 180 bottom
R100  19.81,12.88 180 bottom
R101  6.1,13.97 180 bottom
R102  15.6,14.45 270 bottom
R103  22.15,15.39 90 bottom
R104  10.79,16.26 90 bottom
R105  55.37,22.58 180 bottom
R106  41.4,22.58 180 bottom
R107  55.37,24.61 180 bottom
R108  41.4,24.61 180 bottom
R109  16.05,25.83 180 bottom
R110  17.48,28.04 180 bottom
R111  12.19,34.29 0 bottom
R112  25.15,36.83 180 bottom
R113  11.43,37.85 270 bottom
R114  25.15,38.86 0 bottom
REG  16.51,7.62 180 top
SHUTDOWN_B  39.62,3.3 270 top
SHUTDOWN_BUTTON  82.55,13.34 270 top
SHUTDOWN_C  53.59,3.3 270 top
SHUTDOWN_D  67.56,3.3 270 top
SHUTDOWN_E  77.22,3.3 270 top
SOFTWARE  21.59,40.01 270 top
STATUS_3.1  68.33,78.49 0 top
STATUS_3.2  42.75,52.53 180 top
U1  60.71,59.69 0 top
U100  6.35,37.85 0 bottom
U$1  [M3_MOUNTING]  3,80.82 0 top
U$2  [M3_MOUNTING]  83.36,80.82 0 top
U$3  67.31,64.77 90 top
U$4  43.94,62.74 180 top
U$5  45.97,58.29 90 top
U$8  79.38,22.45 180 bottom
U$100  19.23,20.8 90 bottom
WATCHDOG_OK  53.85,56.13 270 top

### Tracks (layer width: path | path; a pad name or v marks a point on that pad's centre or on a via)
12V_READ
  Top 0.254: R10.1 52.62,47.09 R12.2 49.9,45.16 40.01,45.16 39.37,45.8 39.37,52.55 33.02,58.9 $$U$6.A2
!FLT!
  Bottom 0.254: LED2.C 20.19,23.72 U$100.14
+3V3  (via drill 0.35)
  Top 0.508: U$4.VCC v43.94,60.45 44.22,60.45 U$5.5
  Bottom 0.508: v43.94,60.45 14.48,60.45 $$U$6.3.3V
+5V  (via drill 0.35, 0.51)
  Top 0.254: $$U$6.VIN 7.62,56.9 10.79,53.72 v10.95,53.72 | R11.1 13.12,44.45 2.54,44.45 | v10.82,72.77 10.29,72.77 7.62,75.44
  Top 0.508: $$U$6.VIN 5.59,62.23 5.59,73.41 7.62,75.44 U$3.VIN | 2.03,59.94 2.03,44.45 | 2.03,44.45 2.03,44.2 | 2.54,44.45 2.03,44.45 | v12.83,30.48 R24.1
  Top 1.016: REG.3 10.81,10.78 POWERTAIL.P$1 6.24,10.78 2.03,14.99 2.03,44.2 2.03,59.94 4.32,62.23 5.59,62.23
  Bottom 0.254: C108.2 16.51,72.56 | 16.51,72.56 C109.2 | 16.51,72.56 16.3,72.77 CAN_TRANSCEIVER_3.101.3 v10.82,72.77 | C106.2 C107.2 16.17,53.72 CAN_TRANSCEIVER_3.100.3 v10.95,53.72
  Bottom 0.508: v12.83,30.48 12.88,30.48 13.28,30.07 13.28,8.31 REG.3
  Bottom 1.016: REG.3 13.12,6.77 C101.2
+12V  (via drill 0.35, 0.51)
  Top 0.254: v59.44,19.02 65.79,19.02 67.94,16.87 67.94,15.88 68.1,15.71 70.58,15.71 73.08,18.21 v77.76,18.21 | v58.5,42.32 D2.A
  Top 0.508: U1.4 v59.44,59.13
  Top 0.889: 14.26,18 15.42,19.15 v22.35,19.15 59.31,19.15 v59.44,19.02 | MAIN.P$4 8.7,20.57 11.68,20.57 14.26,18 | REG.1 19.05,13.21 14.26,18
  Bottom 0.254: 59.18,41.53 59.18,41.63 v58.5,42.32 | v77.76,18.21 78.11,18.56 U$8.4
  Bottom 0.457: U$100.15 20.88,24.79 21.23,25.15 21.54,24.84 U$100.16
  Bottom 0.508: v59.44,19.02 59.18,19.28 59.18,41.53 59.18,58.88 v59.44,59.13
  Bottom 0.889: v22.35,19.15 22.5,19.3 22.5,25.45 21.23,26.72 | 21.23,25.15 21.23,26.72 | REG.1 19.9,6.77 C100.2 | C103.1 21.23,28.39 21.23,26.72
BMS_OK  (via drill 0.35)
  Top 0.254: R23.1 11.56,33.66 10.68,32.78 9.58,32.78 7.7,30.9 7.7,29.57 8.13,29.13 9.75,29.13 10.21,28.68 10.21,26.78 MAIN.P$7 10.14,25.42 12.17,23.39 52.4,23.39 v53.23,22.56
  Bottom 0.254: R107.1 R105.1 53.25,22.58 v53.23,22.56
BMS_OK_RELAY
  Bottom 0.254: BMS_SHUTDOWN_RLY.COIL+ 55.37,28.69 D103.C 56.22,27.74 R107.2
BMS_PWR_STEP
  Bottom 0.254: 53.34,27.79 53.34,23.6 51.56,21.82 51.56,15.9 55.35,12.12 BMS_SHUTDOWN_RLY.3 | D103.A 53.34,27.79 | 53.34,27.79 52.45,27.79 48.11,32.13 BMS_SHUTDOWN_RLY.COIL- 47.87,32.12 D105.A
CANH
  Bottom 0.254: 5.89,55.58 5.89,73.2 6.73,74.04 CAN_TRANSCEIVER_3.101.7 | CAN_TRANSCEIVER_3.100.7 6.48,54.99 5.89,55.58 | MAIN.P$1 CAN_TERM.1 5.4,34.99 U100.2 5.4,47.77 5.89,48.26 5.89,55.58
CANL
  Bottom 0.254: CAN_TRANSCEIVER_3.100.6 8.51,53.72 9.04,54.25 | CAN_TRANSCEIVER_3.101.6 8.28,72.77 9.04,72.01 9.04,54.25 | MAIN.P$2 6.58,27.92 7.62,28.96 7.62,36.53 U100.1 7.33,36.87 8.34,36.87 10.16,38.7 R113.1 9.04,41.09 9.04,54.25
CHARGE_CONTROL
  Top 0.508: $$U$7.C2 68.56,63.99 67.32,62.75 66.55,62.75 | 66.55,62.75 D1.C 65.09,62.69 U1.3 | 66.55,62.75 68.28,61.02 R6.2
CHARGE_ENABLE
  Bottom 0.508: MAIN.P$8 10.55,21.22 10.79,20.98 D101.3 10.79,19.56 R104.2
CHARGER_1
  Bottom 0.508: CHARGE.P$1 84.33,73.89 84.33,44.97 $$U$7.S1
CHARGER_2
  Bottom 0.508: CHARGE.P$2 82.55,71 81.39,69.84 $$U$7.S2
DVDT_A
  Bottom 0.254: U$100.12 18.9,24.66 19.23,24.99 19.23,29.3 C104.1
FUSE_IN
  Top 1.524: POWER.P$1 POWER.P$3 25.42,16.21 F1.L1 F1.L2
  Bottom 0.254: R34.2 22.78,30.64 22.78,26.52 23.32,25.98 23.32,22.4 24.02,21.7 24.09,21.63 | 24.09,21.63 24.14,21.58 24.14,21.92 C102.1 24.09,21.63 | D100.C 25.42,11.03
  Bottom 0.457: U$100.1 21.54,16.85 R103.2 21.1,16.24 20.88,16.46 U$100.2
  Bottom 0.889: R103.2 24.02,18.11 | 24.02,21.7 24.02,18.11 | 24.02,18.11 24.02,17.61 F1.L1
  Bottom 1.524: 25.42,11.03 POWER.P$3
GND  (via drill 0.35)
  Top 0.203: 68.56,45.82 68.56,50.11 62,56.67 | 62,56.67 U1.2 | 54.9,58.2 54.9,56.43 WATCHDOG_OK.C | 56.65,62.03 57.4,62.79 R5.1 58.47,63.08 58.93,63.54 59.94,63.54 60.09,63.4 60.09,61.32 60.46,60.95 D1.A 62,57.8 62,56.67 | 56.65,62.03 56.65,59.95 54.9,58.2 | 56.65,62.03 55.78,62.03 R4.1 R3.1 50.37,61.38 R2.1 46.9,61.38 46.18,62.1 U$4.GND U$4.EN | R16.2 58.09,38.94 61,36.02 62.26,36.02 62.49,36.25 62.49,37.99 R18.2 | v46.99,58.17 46.99,56.94 U$5.3 47.56,57.58 54.28,57.58 54.9,58.2 | 5.59,51.31 10.83,51.31 v14.73,55.21 | U$3.GND 14.73,73.15 v14.73,74.26 | 77.26,2.3 77.97,3 SHUTDOWN_E.C
  Top 0.254: R18.2 68.56,44.06 $$U$7.C1 68.56,45.82 | v41.4,5.33 41.4,4.03 40.67,3.3 SHUTDOWN_B.C 40.3,3.3 39.31,2.32 31.95,2.32 POWER.P$2 | 67.28,2.3 68.29,3.3 SHUTDOWN_D.C 69.34,4.33 BMS_SHUTDOWN_RLY1.4 | 67.28,2.3 61.09,2.3 60.09,3.3 SHUTDOWN_C.C 55.37,4.33 BMS_SHUTDOWN_RLY.4 | R17.2 34.52,37.97 34.52,36.19 33.2,34.87 | 33.2,34.87 28.82,30.48 POWER_5V.C BMS_OK.C | 33.2,34.87 32.73,35.34 32.73,38.4 32.35,38.77 31.73,38.77 30.8,37.85 22.64,37.85 22.34,37.55 OKHS.C | MAIN.P$3 6.26,25.51 4.53,25.51 3.85,26.19 3.85,27.15 4.01,27.31 v4.01,36.58 | 67.28,2.3 77.26,2.3 | v43.98,55.88 43.98,52.71 43.05,51.78 STATUS_3.2.C | v4.04,39.75 4.04,42.24 LATCH_BUTTON.B1 v7.62,42.64 LATCH_BUTTON.B2 11.6,42.67 v12.98,42.67 | v6.68,57.66 6.35,57.66 5.59,56.9 5.59,51.31 5.59,47.67 6.27,46.99 $$U$6.GND | R10.2 62,54.77 62,56.67 | 68.31,79.22 STATUS_3.1.C 68.29,79.2 v65.91,79.2 | 83.86,22.75 12V_OK.C | R14.2 47.61,36.18 48.77,35.03 60.01,35.03 61,36.02 | v12.98,42.67 | SOFTWARE.C 22.52,40.18 v23.93,40.18
  Top 0.508: v15.92,22.71 v14.2,22.71 | LED1.C 65.04,60.83 D1.A
  Top 1.524: POWER.P$4 POWER.P$2
  Bottom 0.203: C106.1 C107.1 v14.73,55.21 12.97,55.21 CAN_TRANSCEIVER_3.100.2 | v43.98,55.88 48.01,55.88 48.01,58.17 v46.99,58.17 | v6.68,57.66 7.56,57.66
  Bottom 0.254: C105.2 24.13,38.7 24.23,38.8 | 24.23,38.8 R114.2 | $$U$6.GND v7.62,42.64 7.62,40.12 U100.3 | CAN_TRANSCEIVER_3.100.8 7.56,57.66 7.56,60.29 6.64,61.22 6.64,65.06 U$3.GND | CAN_TRANSCEIVER_3.101.8 10.09,75.31 10.67,75.89 13.98,75.89 14.14,75.73 14.14,74.89 13.98,74.73 13.45,74.73 CAN_TRANSCEIVER_3.101.2 12.97,74.26 v14.73,74.26 C109.1 C108.1 20.32,74.26 21.79,72.78 54.3,72.78 60.72,79.2 v65.91,79.2 | R106.2 42.25,18.91 42.81,18.36 42.81,8.52 IMD_SHUTDOWN_RLY.4 | R105.2 56.22,18.91 56.78,18.36 56.78,8.52 BMS_SHUTDOWN_RLY.4 53.59,5.33 43.18,5.33 IMD_SHUTDOWN_RLY.4 | IMD_SHUTDOWN_RLY.4 v41.4,5.33 | C101.1 14.67,5.08 13.8,4.22 12.41,4.22 12.19,4.44 12.19,12.75 Q100.2 11.74,16.26 | 11.74,16.26 D101.1 | 11.74,16.26 8.49,16.26 LATCHING.P$1 | LATCHING.P$1 6.33,18.38 4.53,18.38 3.8,17.65 3.8,16.56 5.25,15.12 R101.1 | LATCHING.P$1 6.35,21.1 5.09,22.36 5.09,23.41 6.35,24.66 MAIN.P$3 | v4.04,39.75 4.04,36.61 v4.01,36.58 | 15.7,38.7 C105.2 | C105.2 13.46,42.19 v12.98,42.67 | v23.93,40.18 24.23,39.88 24.23,38.8
  Bottom 0.508: C101.1 14.82,5.93 REG.2 18.2,5.93 C100.1 18.19,5.07 18.19,3.81 18.72,3.28 26.5,3.28 27.93,4.71 27.93,6.18 | U$100.9 v15.92,22.71 | D100.A 27.92,10.27 POWER.P$4 27.92,9.02
  pour Top: 70.48,83.82 70.56,44.96 70.53,36.38 76.66,30.25 86.51,30.25 86.51,0 0,0 0,83.82
  pour Bottom: 0,83.82 70.54,83.82 70.48,78.25 70.48,78.26 70.48,38 70.49,36.42 76.61,30.3 86.46,30.3 86.46,0.08 0,0.08
ILIM_A
  Bottom 0.254: U$100.11 18.24,27.95 R110.2
IMD_OK  (via drill 0.35)
  Top 0.254: MAIN.P$6 7.57,26.64 7.57,25.07 8.48,24.16 10.29,24.16 12.7,21.74 38.86,21.74 v39.29,22.17 | v14.38,35.23 14.39,35.24 R20.1
  Bottom 0.254: R108.1 R106.1 39.7,22.58 v39.29,22.17 | MAIN.P$6 14.38,33.45 v14.38,35.23
IMD_PWR_STEP
  Bottom 0.254: D106.A 33.9,32.12 IMD_SHUTDOWN_RLY.COIL- 34.39,32.13 38.56,27.96 | 38.56,27.96 40.32,27.96 D104.A | IMD_SHUTDOWN_RLY.3 38.56,14.96 38.56,27.96
IMON_B_READ  (via drill 0.35)
  Top 0.254: v45.03,30.83 45.03,36.46 39.24,42.25 32.68,42.25 29.26,45.67 29.26,52.27 22.86,58.67 $$U$6.A6 | v16.33,20.83 44.35,20.83 v45.09,21.56
  Bottom 0.254: R109.2 17.58,25.16 U$100.10 17.58,22.91 16.33,21.67 v16.33,20.83 | v45.09,21.56 45.03,21.61 v45.03,30.83
LATCH_EXT_BUTTON  (via drill 0.35, 0.51)
  Top 0.254: v57.4,33.78 64.68,33.78 D7.C
  Top 0.508: LATCHING.P$2 6.06,15.61 4.21,15.61 3.1,16.71 3.1,37.69 3.54,38.14 LATCH_BUTTON.A1 LATCH_BUTTON.A2 11.6,40.55 12.7,41.66 22.1,41.66 22.34,41.9 LATCH.C 25.69,43.18 25.72,43.2 25.72,43.19 v27.38,41.53
  Bottom 0.254: v57.4,33.78 45.35,33.78 D105.C
  Bottom 0.508: v27.38,41.53 31.24,37.67 D106.C D105.C
N$1
  Bottom 0.508: POWERTAIL.P$2 9.29,8.28 10.79,9.78 Q100.3
N$2
  Top 0.508: R11.2 LATCH.A
N$3
  Top 0.254: R23.2 BMS_OK.A
N$4
  Bottom 0.254: CAN_TRANSCEIVER_3.101.4 18.67,71.5 20.32,69.85 U$3.D4(CANRX)
N$5
  Bottom 0.508: R104.1 9.85,14.46 Q100.1 8.64,13.19 7.86,13.97 R101.2
N$6
  Bottom 0.254: U$3.D3(CANTX) 17.78,67.31 17.02,68.07 12.7,68.07 10.16,70.61 10.16,74.8 10.67,75.31 CAN_TRANSCEIVER_3.101.1
N$7
  Top 0.254: R1.1 STATUS_3.1.A
N$8
  Top 0.254: R8.1 42.72,53.3 STATUS_3.2.A
N$9
  Top 0.254: R1.2 66.71,71.79 U$3.D30
N$10
  Top 0.254: U1.1 58.56,56.69 R9.2
N$11
  Top 0.254: R5.2 57.4,56.96 55.44,54.99 46.62,54.99 45.02,56.6 U$5.1 45.02,58.46 44.05,59.44 40.64,59.44 38.1,61.98 $$U$6.A0
N$12
  Bottom 0.254: R108.2 42.3,24.66 D104.C 42.3,31.23 IMD_SHUTDOWN_RLY.COIL+
N$13  (via drill 0.35)
  Top 0.254: R26.1 79.08,28.42 R27.1 | R27.1 80.12,29.41 83.86,29.41 R25.1 | R27.1 79.4,28.11 v79.4,26.98
  Bottom 0.254: v79.4,26.98 79.4,20.7 U$8.3
N$14
  Bottom 0.254: D107.C 24.38,36.74 R112.1
N$15
  Bottom 0.254: $$U$6.D4(CANRX) 20.32,51.05 18.92,52.45 CAN_TRANSCEIVER_3.100.4
N$16
  Top 0.254: U$4.WDI 42.93,63.75 | 42.93,63.75 48.6,63.75 R2.2 | 42.93,63.75 42.16,63.75 $$U$6.D13
N$17
  Bottom 0.254: R111.2 11.09,34.04 CAN_TERM.2
N$18
  Top 0.254: R21.1 D4.C
N$19
  Top 0.254: R29.2 SHUTDOWN_B.A
N$20
  Top 0.254: D5.C 52.62,36.88 R19.1
N$21
  Top 0.254: R22.1 D6.C
N$22
  Bottom 0.254: $$U$6.D3(CANTX) 17.78,48.77 16,50.55 11.94,50.55 10.16,52.32 10.16,55.63 10.79,56.26 CAN_TRANSCEIVER_3.100.1
N$23
  Top 0.254: BMS_SHUTDOWN_RLY1.COIL- 64.48,32.13 D7.A
  Bottom 0.254: BMS_SHUTDOWN_RLY1.3 67.57,13.88 67.57,20.11 D102.A 68.54,24.83 61.85,31.52 BMS_SHUTDOWN_RLY1.COIL-
N$24
  Top 0.254: R7.2 WATCHDOG_OK.A
N$25
  Top 0.254: R24.2 POWER_5V.A
N$26
  Top 0.254: R20.2 OKHS.A
N$27
  Bottom 0.254: R28.2 76.9,24.25 U$8.1
N$28
  Top 0.254: D3.C 44.5,39.23 R13.1
N$29
  Top 0.254: SHUTDOWN_E.A R32.2
N$30
  Top 0.254: R31.2 SHUTDOWN_D.A
N$31
  Top 0.254: R15.2 SOFTWARE.A
N$32
  Top 0.254: R30.2 SHUTDOWN_C.A
N$33
  Top 0.254: BMS_SHUTDOWN_RLY1.COIL+ 70.84,32.13 74.55,28.42 R26.2
  Bottom 0.254: D102.C 70.34,31.13 BMS_SHUTDOWN_RLY1.COIL+
N$34
  Top 0.254: R25.2 84.12,25.46 12V_OK.A
N$35
  Bottom 0.254: R33.2 18.24,16.95 U$100.6
N$36
  Bottom 0.254: R34.1 19.8,27.81 LED2.A
N$40
  Top 0.508: R6.1 68.26,58.32 LED1.A
N$42
  Top 0.254: D2.C 54.44,42.32 R12.1
N$61
  Bottom 0.508: U$3.GND2 36.2,73.66 $$$$U$100.-
N$62
  Bottom 0.254: R113.2 C105.1 13.46,34.71 R111.1
OVP_A
  Bottom 0.254: U$100.5 18.9,12.94 R100.1 16.32,12.88 R102.2
RTN_A
  Bottom 0.254: C104.2 R110.1 15.2,26.62 R109.1 15.16,25.79 15.16,19.61 16.87,17.91 U$100.8 | U$100.8 16.92,17.18 15.6,15.86 R102.1 17.07,15.3 R33.1 | U$100.8 16.92,19.68 18.03,20.8 U$100.PAD
SHUTDOWN_A
  Bottom 0.254: F1.R1 25.15,31.36 D107.A
  Bottom 1.524: F1.R1 F1.R2 30.84,26.39 36.83,20.4 36.83,15.04 IMD_SHUTDOWN_RLY.6
SHUTDOWN_A_READ  (via drill 0.35)
  Top 0.254: v21.77,45.06 21.77,55.7 $$U$6.A9
  Bottom 0.254: R112.2 R114.1 26,40.83 v21.77,45.06
SHUTDOWN_B  (via drill 0.51)
  Top 0.254: R29.1 33.91,3.52 IMD_SHUTDOWN_RLY.5
  Top 0.508: v43.54,30.43 43.54,35.69 42.42,36.8 D4.A
  Top 1.524: IMD_SHUTDOWN_RLY.5 36.5,9.7 45.47,9.7 BMS_SHUTDOWN_RLY.6
  Bottom 0.508: v43.54,30.43 43.54,14.35 45.8,12.09 47.85,12.09 BMS_SHUTDOWN_RLY.6
SHUTDOWN_B_READ
  Top 0.254: R21.2 R17.1 33.15,38.84 29.21,42.77 27.53,42.77 24.05,46.25 24.05,54.77 17.78,61.04 $$U$6.A8
SHUTDOWN_C  (via drill 0.35)
  Top 0.254: BMS_SHUTDOWN_RLY.5 47.88,3.52 R30.1 | D5.A v56.44,36.8
  Top 1.524: BMS_SHUTDOWN_RLY.5 50.37,9.6 59.59,9.6 61.85,11.86 BMS_SHUTDOWN_RLY1.6
  Bottom 0.254: v56.44,36.8 56.64,36.8 58.17,35.28 58.17,15.77 61.82,12.12 BMS_SHUTDOWN_RLY1.6
SHUTDOWN_C_READ
  Top 0.254: R19.2 49.42,36.91 R16.1 49.38,38.98 49.38,41.81 47.32,43.87 35.99,43.87 34.54,45.31 34.54,49.78 27.91,56.41 27.91,62.2 $$U$6.A4
SHUTDOWN_D  (via drill 0.35)
  Top 0.254: BMS_SHUTDOWN_RLY1.5 61.85,3.52 R31.1 | v68.45,34.9 D6.A
  Top 1.524: BMS_SHUTDOWN_RLY1.5 64.29,9.55 73.23,9.55 74.27,10.59 81.06,10.59 SHUTDOWN_BUTTON.P$2
  Bottom 0.254: SHUTDOWN_BUTTON.P$2 82.53,12.06 74.28,12.06 71.37,14.96 71.37,33.22 69.7,34.9 v68.45,34.9
SHUTDOWN_D_READ
  Top 0.254: R22.2 R18.1 61.63,40.64 51.77,40.64 47.88,44.53 38.68,44.53 36.75,46.46 36.75,53.21 30.48,59.49 $$U$6.A3
SHUTDOWN_E  (via drill 0.35)
  Top 0.254: R32.1 72.26,3.34 72.26,5.21 v72.9,5.84 | 46.71,28.7 46.05,29.36 46.05,37.28 D3.A
  Top 1.524: MAIN.P$5 10.47,30.42 12.19,28.7 46.71,28.7 72.14,28.7 82.55,18.29 SHUTDOWN_BUTTON.P$1
  Bottom 0.254: v72.9,5.84 77.48,10.42 83.22,10.42 84.16,11.36 84.16,12.76 82.55,14.37 SHUTDOWN_BUTTON.P$1
SHUTDOWN_E_READ
  Top 0.254: R14.1 45.89,41.27 R13.2 42.33,43.1 34.04,43.1 31.75,45.39 31.75,51.21 25.4,57.56 $$U$6.A5
SOFTWARE_SHUTDOWN  (via drill 0.35, 0.38)
  Top 0.254: R15.1 15.38,39.01 29.64,39.01 v30.68,40.06 | U$5.4 52.37,59.64 52.79,60.07 53.43,60.07 | R4.2 53.43,60.07 | v54.86,60.07 53.43,60.07
  Bottom 0.254: v30.68,40.06 36.5,40.06 54.86,58.42 v54.86,60.07 59.14,60.07 59.16,60.1 59.71,60.1 67.11,52.7 67.11,38.33 71.91,33.52 71.91,19.2 74.19,16.92 R28.1
STATUS_3.2
  Top 0.254: R8.2 41.12,56.68 40.64,56.2 37.78,56.2 35.56,58.42 $$U$6.A1
TOGGLE_CHARGER
  Top 0.254: R9.1 48.98,53.14 42.84,46.99 $$U$6.D12
UVLO_A
  Bottom 0.254: R103.1 22.15,14.37 R100.2 | 20.22,13.32 U$100.3
  Bottom 0.406: R100.2 20.22,13.32
VBAT_RTC
  Bottom 0.508: $$$$U$100.+_0 $$$$U$100.+_1 44.83,57.78 52.07,65.02 52.07,67.31 U$3.VBAT
WATCHDOG_OK
  Top 0.254: U$4.WDO 45.97,61.37 45.97,60.45 | 45.97,60.45 U$5.2 45.97,56.22 46.08,56.11 49.55,56.11 R7.1 | 45.97,60.45 51.14,60.45 R3.2

### Text on the board
tDocu: GLV | GLV | TS | HyTech Racing 2020 / Charger Control Board rev6 / Designed by Arvind Srinivasan, Yvonne Yeh, / Cody Kaminsky | GLV | TS | GLV | TS | TS | GLV
bDocu: GLV | TS | GLV | TS | GLV | TS | TS | GLV